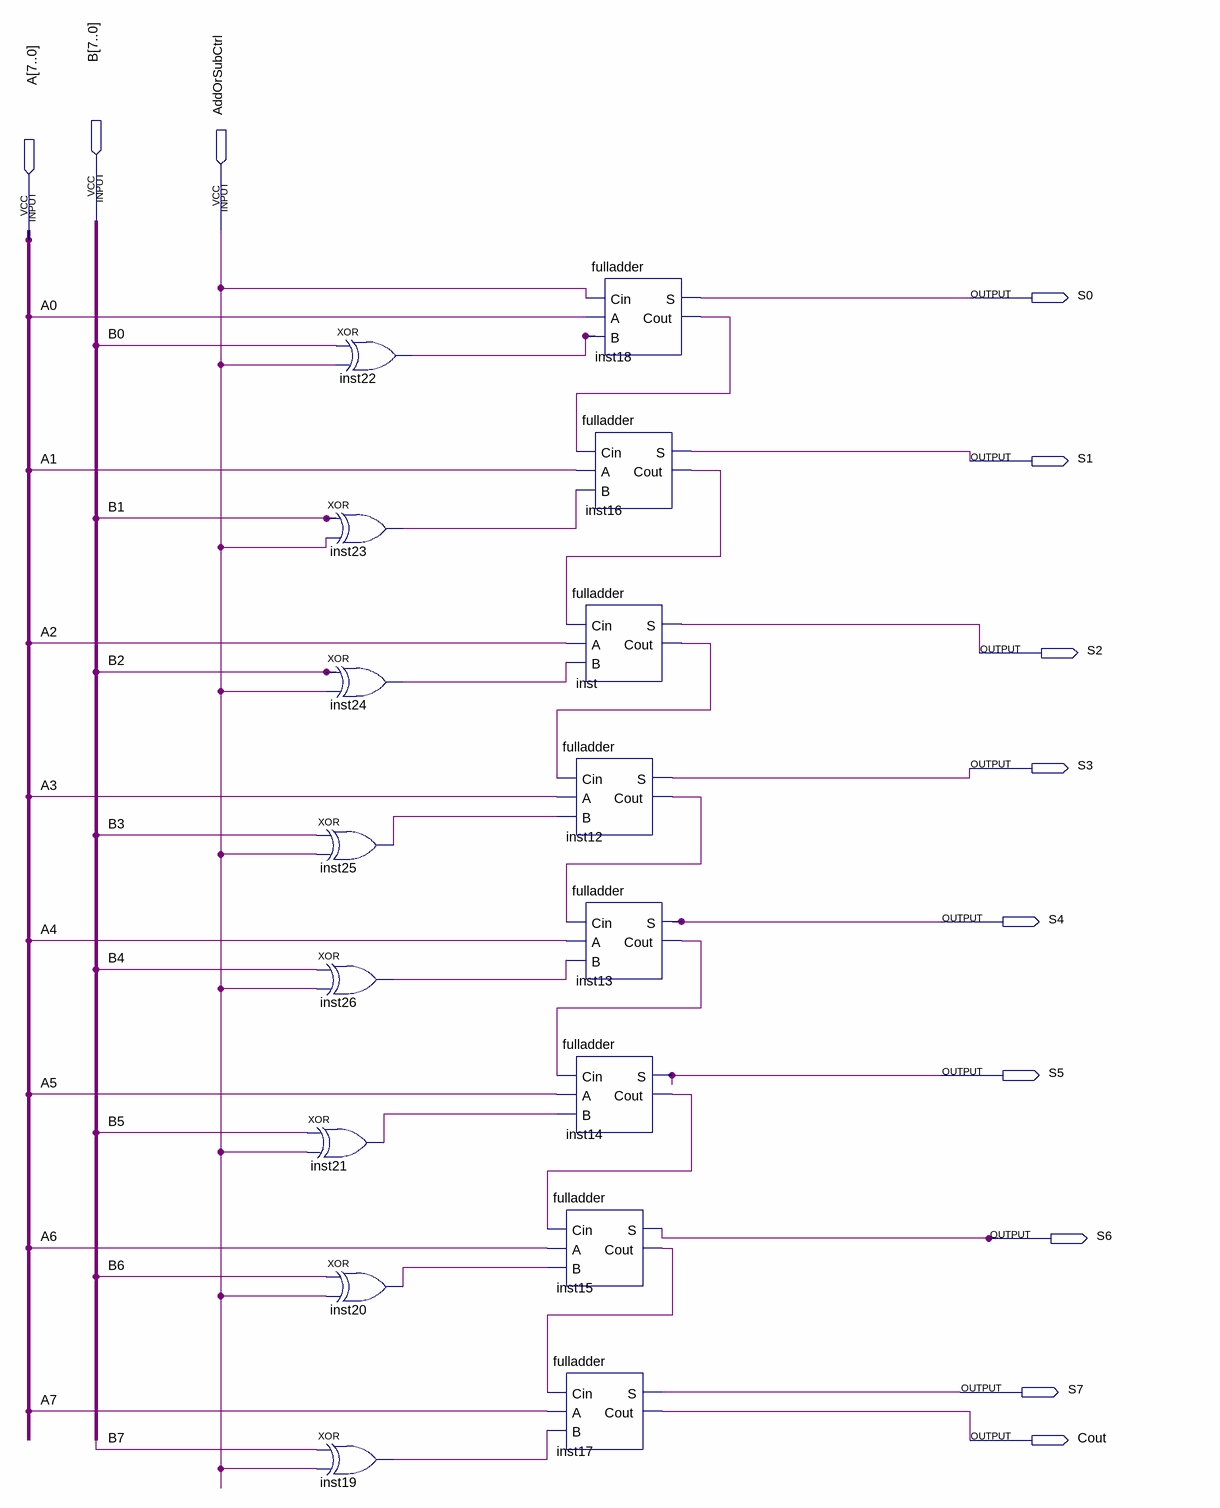
[diagram p0: schematic sheet]
// Quartus schematic adderOrSub.bdf as structural Verilog: 16 symbols, 12 pins
module adderOrSub (
  input  [7:0] B,
  input  AddOrSubCtrl,
  input  [7:0] A,
  output S0,
  output S1,
  output S2,
  output S3,
  output S4,
  output S5,
  output S6,
  output S7,
  output Cout
);

  wire inst12_cout, inst13_cout, inst14_cout, inst15_cout, inst16_cout, inst18_cout, inst19_out, inst20_out,
       inst21_out, inst22_out, inst23_out, inst24_out, inst25_out, inst26_out, inst_cout;

  xor inst22 (inst22_out, B[0], AddOrSubCtrl);
  xor inst23 (inst23_out, B[1], AddOrSubCtrl);
  xor inst24 (inst24_out, B[2], AddOrSubCtrl);
  xor inst25 (inst25_out, B[3], AddOrSubCtrl);
  xor inst26 (inst26_out, B[4], AddOrSubCtrl);
  xor inst21 (inst21_out, B[5], AddOrSubCtrl);
  xor inst20 (inst20_out, B[6], AddOrSubCtrl);
  xor inst19 (inst19_out, B[7], AddOrSubCtrl);
  fulladder inst (.Cin(inst16_cout), .A(A[2]), .B(inst24_out), .S(S2), .Cout(inst_cout));
  fulladder inst12 (.Cin(inst_cout), .A(A[3]), .B(inst25_out), .S(S3), .Cout(inst12_cout));
  fulladder inst13 (.Cin(inst12_cout), .A(A[4]), .B(inst26_out), .S(S4), .Cout(inst13_cout));
  fulladder inst14 (.Cin(inst13_cout), .A(A[5]), .B(inst21_out), .S(S5), .Cout(inst14_cout));
  fulladder inst15 (.Cin(inst14_cout), .A(A[6]), .B(inst20_out), .S(S6), .Cout(inst15_cout));
  fulladder inst17 (.Cin(inst15_cout), .A(A[7]), .B(inst19_out), .S(S7), .Cout(Cout));
  fulladder inst18 (.Cin(AddOrSubCtrl), .A(A[0]), .B(inst22_out), .S(S0), .Cout(inst18_cout));
  fulladder inst16 (.Cin(inst18_cout), .A(A[1]), .B(inst23_out), .S(S1), .Cout(inst16_cout));
endmodule
